# Altium schematic sheet fastedge-ADCMP572.SchDoc
size A4; SheetNumber: 1; SheetTotal: 1
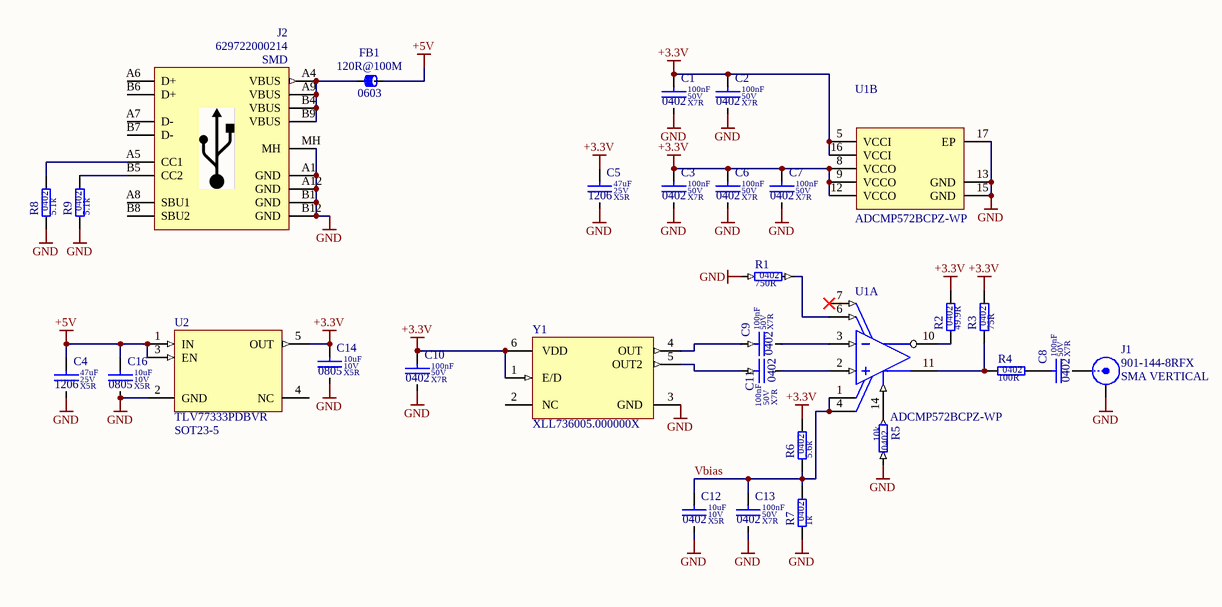
[diagram p0: fastedge-ADCMP572.SchDoc]

## Parts
C1  value 100nF  Dielectric: X7R  Voltage: 50V  SCH_Footprint: 0402  [C_0402_1005]  (hidden comment: Ceramic X7R)
C2  value 100nF  Dielectric: X7R  Voltage: 50V  SCH_Footprint: 0402  [C_0402_1005]  (hidden comment: Ceramic X7R)
C3  value 100nF  Dielectric: X7R  Voltage: 50V  SCH_Footprint: 0402  [C_0402_1005]  (hidden comment: Ceramic X7R)
C4  value 47uF  Dielectric: X5R  Voltage: 25V  SCH_Footprint: 1206  [C_1206_3216]  (hidden comment: Ceramic X5R)
C5  value 47uF  Dielectric: X5R  Voltage: 25V  SCH_Footprint: 1206  [C_1206_3216]  (hidden comment: Ceramic X5R)
C6  value 100nF  Dielectric: X7R  Voltage: 50V  SCH_Footprint: 0402  [C_0402_1005]  (hidden comment: Ceramic X7R)
C7  value 100nF  Dielectric: X7R  Voltage: 50V  SCH_Footprint: 0402  [C_0402_1005]  (hidden comment: Ceramic X7R)
C8  value 100nF  Dielectric: X7R  Voltage: 50V  SCH_Footprint: 0402  [C_0402_1005]  (hidden comment: Ceramic X7R)
C9  value 100nF  Dielectric: X7R  Voltage: 50V  SCH_Footprint: 0402  [C_0402_1005]  (hidden comment: Ceramic X7R)
C10  value 100nF  Dielectric: X7R  Voltage: 50V  SCH_Footprint: 0402  [C_0402_1005]  (hidden comment: Ceramic X7R)
C11  value 100nF  Dielectric: X7R  Voltage: 50V  SCH_Footprint: 0402  [C_0402_1005]  (hidden comment: Ceramic X7R)
C12  value 10uF  Dielectric: X5R  Voltage: 10V  SCH_Footprint: 0402  [C_0402_1005]  (hidden comment: Ceramic X5R)
C13  value 100nF  Dielectric: X7R  Voltage: 50V  SCH_Footprint: 0402  [C_0402_1005]  (hidden comment: Ceramic X7R)
C14  value 10uF  Dielectric: X5R  Voltage: 10V  SCH_Footprint: 0805  [C_0805_2012]  (hidden comment: Ceramic X5R)
C16  value 10uF  Dielectric: X5R  Voltage: 10V  SCH_Footprint: 0805  [C_0805_2012]  (hidden comment: Ceramic X5R)
FB1  value 120R@100M  SCH_Footprint: 0603  [FB_0603_1608]  (hidden comment: Ferrite bead)
J1  value 901-144-8RFX  [J_SMA_VERTICAL]  (hidden comment: SMA VERTICAL)
J2  value 629722000214  SCH_Footprint: SMD  [J_USB_C_629722000214]  (hidden comment: USB 2.0 Type C)
R1  value 750R  SCH_Footprint: 0402  [R_0402_1005]  (hidden comment: Resistor)
R2  value 49.9R  SCH_Footprint: 0402  [R_0402_1005]  (hidden comment: Resistor)
R3  value 75R  SCH_Footprint: 0402  [R_0402_1005]  (hidden comment: Resistor)
R4  value 100R  SCH_Footprint: 0402  [R_0402_1005]  (hidden comment: Resistor)
R5  value 10k  SCH_Footprint: 0402  [R_0402_1005]  (hidden comment: Resistor)
R6  value 5.6k  SCH_Footprint: 0402  [R_0402_1005]  (hidden comment: Resistor)
R7  value 1k  SCH_Footprint: 0402  [R_0402_1005]  (hidden comment: Resistor)
R8  value 5.1k  SCH_Footprint: 0402  [R_0402_1005]  (hidden comment: Resistor)
R9  value 5.1k  SCH_Footprint: 0402  [R_0402_1005]  (hidden comment: Resistor)
U1  ADCMP572BCPZ-WP  [ADI-CP-16-3_L]  (parts A,B of 2)
U2  value TLV77333PDBVR  SCH_Footprint: SOT23-5  [SOT23-5_SC74A_SOT753_M]  (hidden comment: LDO Voltage Regulators 300-mA high-PSRR low -IQ low-dropout regu)
Y1  XLL736005.000000X  [JU6_MFG]

## Nets
+3.3V: C1.1 C2.1 C3.1 C5.1 C6.1 C7.1 C10.1 C14.1 R2.2 R3.2 R6.2 U1.5(VCCI) U1.8(VCCO) U1.9(VCCO) U1.12(VCCO) U1.16(VCCI) U2.5(OUT) Y1.1(E/D) Y1.6(VDD)
+5V: C4.1 C16.1 FB1.2 U2.1(IN) U2.3(EN)
GND: C1.2 C2.2 C3.2 C4.2 C5.2 C6.2 C7.2 C10.2 C12.2 C13.2 C14.2 C16.2 J1.GND J2.A1(GND) J2.A12(GND) J2.B1(GND) J2.B12(GND) J2.MH R1.1 R5.2 R7.1 R8.1 R9.1 U1.13(GND) U1.15(GND) U1.17(EP) U2.2(GND) Y1.3(GND)
Vbias: C12.1 C13.1 R6.1 R7.2 U1.1(VTP) U1.4(VTN)
NetC8_1: C8.1 R4.2
NetC8_2: C8.2 J1.1(X)
NetC9_1: C9.1 Y1.4(OUT)
NetC9_2: C9.2 U1.3(VN)
NetC11_1: C11.1 Y1.5(OUT2)
NetC11_2: C11.2 U1.2(VP)
NetFB1_1: FB1.1 J2.A4(VBUS) J2.A9(VBUS) J2.B4(VBUS) J2.B9(VBUS)
NetJ2_A5: J2.A5(CC1) R8.2
NetJ2_B5: J2.B5(CC2) R9.2
NetR1_2: R1.2 U1.6(~{LE})
NetR2_1: R2.1 U1.10(~{Q})
NetR3_1: R3.1 R4.1 U1.11(Q)
NetR5_1: R5.1 U1.14(HYS)

Not connected (* = marked no-connect by the designer): J2 A6(D+) A7(D-) A8(SBU1) B6(D+) B7(D-) B8(SBU2); U1 7(LE)*; U2 4(NC); Y1 2(NC)

## Library data of the parts
C1-C3 C6-C11 C13 = C_100nF_50V_X7R_0402_10: Capacitor; Manufacturer: Murata; Manufacturer Part Number: GRM155R71H104KE14D; Tolerance (%): 10; Part Number: C_100nF_50V_X7R_0402_10; HelpURL: http://docs-europe.electrocomponents.com/webdocs/145f/0900766b8145f9d2.pdf; Supplier 1: TME; Supplier Part Number 1: GRM155R71H104KE14D; Supplier 2: RS Components; Supplier Part Number 2: 8847087; Supplier 3: Farnell; Supplier Part Number 3: 2611912; Supplier 4: Mouser; Supplier Part Number 4: 81-GRM155R71H104KE4D; Supplier 5: Digi-Key; Supplier Part Number 5: 490-10700-1-ND; Supplier 6: LCSC
C4 C5 = C_47uF_25V_X5R_1206_20: Capacitor; Manufacturer: TDK; Manufacturer Part Number: C3216X5R1E476M160AC; Tolerance (%): 20; Part Number: C_47uF_25V_X5R_1206_20; HelpURL: https://product.tdk.com/system/files/dam/doc/product/capacitor/ceramic/mlcc/catalog/mlcc_commercial_general_en.pdf; Supplier 1: TME; Supplier Part Number 1: C3216X5R1E476MAC; Supplier 2: RS Components; Supplier Part Number 2: 7883060P; Supplier 3: Farnell; Supplier Part Number 3: 2525172; Supplier 4: Mouser; Supplier Part Number 4: 810-C3216X5R1E476M; Supplier 5: Digi-Key; Supplier Part Number 5: 445-8047-1-ND; Supplier 6: LCSC
C12 = C_10uF_10V_X5R_0402_20: Capacitor; Manufacturer: Murata; Manufacturer Part Number: GRM155R61A106ME11D; Tolerance (%): 20; Part Number: C_10uF_10V_X5R_0402_20; HelpURL: https://search.murata.co.jp/Ceramy/image/img/A01X/G101/ENG/GRM155R61A106ME11-01A.pdf; Supplier 1: TME; Supplier Part Number 1: GRM155R61A106ME11D; Supplier 2: RS Components; Supplier Part Number 2: 260-8765P; Supplier 3: Farnell; Supplier Part Number 3: 3785802; Supplier 4: Mouser; Supplier Part Number 4: 81-GRM155R61A106ME1D; Supplier 5: Digi-Key; Supplier Part Number 5: 490-GRM155R61A106ME11DCT-ND; Supplier 6: LCSC; Supplier Part Number 6: C408132
C14 C16 = C_10uF_10V_X5R_0805_10: Capacitor; Manufacturer: Kemet; Manufacturer Part Number: C0805C106K8PACTU; Tolerance (%): 10; Part Number: C_10uF_10V_X5R_0805_10; HelpURL: https://www.mouser.pl/datasheet/2/447/KEM_C1006_X5R_SMD-3316465.pdf; Supplier 1: TME; Supplier Part Number 1: C0805C106K8PAC; Supplier 2: RS Components; Supplier Part Number 2: 8029850; Supplier 3: Farnell; Supplier Part Number 3: 1463362; Supplier 4: Mouser; Supplier Part Number 4: 80-C0805C106K8P; Supplier 5: Digi-Key; Supplier Part Number 5: 399-C0805C106K8PAC7800CT-ND; Supplier 6: LCSC
FB1 = FB_BLM18AG121SH1D: Manufacturer: Murata; Current: 800mA; Resistance: 180mR; Part Number: FB_BLM18AG121SH1D; HelpURL: https://www.murata.com/en-us/api/pdfdownloadapi?cate=cgsubChipFerriBead&partno=BLM18AG121SH1%23; Manufacturer Part Number: BLM18AG121SH1D; Supplier 1: TME; Supplier Part Number 1: BLM18AG121SH1D; Supplier 2: RS Components; Supplier 3: Farnell; Supplier Part Number 3: 2443234; Supplier 4: Mouser; Supplier Part Number 4: 81-BLM18AG121SH1D; Supplier 5: Digi-Key; Supplier Part Number 5: 490-11024-1-ND; Supplier 6: LCSC
J1 = J_SMA_VERTICAL: SMA connector; Manufacturer: Amphenol; SCH_Footprint: SMA VERTICAL; Part Number: J_SMA_VERTICAL; HelpURL: http://www.mouser.com/ds/2/18/C901-144-8RFX-710432.pdf; Manufacturer Part Number: 901-144-8RFX; Supplier 1: TME; Supplier Part Number 1: 901-144-8RFX; Supplier 2: RS Components; Supplier Part Number 2: 1440894; Supplier 3: Farnell; Supplier Part Number 3: 1339820; Supplier 4: Mouser; Supplier Part Number 4: 523-901-144-8RFX; Supplier 5: Digi-Key; Supplier Part Number 5: ARFX1231-ND; Supplier 6: LCSC
J2 = J_USB_C_629722000214: Manufacturer: Wurth; Part Number: J_USB_C_629722000214; HelpURL: https://www.we-online.com/components/products/datasheet/629722000214.pdf; Manufacturer Part Number: 629722000214; Supplier 1: TME; Supplier 2: RS Components; Supplier 3: Farnell; Supplier Part Number 3: 4146212; Supplier 4: Mouser; Supplier Part Number 4: 710-629722000214; Supplier 5: Digi-Key; Supplier Part Number 5: 732-629722000214CT-ND; Supplier 6: LCSC
R1 = R_750R_0402_1: Manufacturer: Panasonic; Manufacturer Part Number: ERJ-S02F7500X; Voltage: 50V; Power: 100mW; Tolerance: 1%; Part Number: R_750R_0402_1; HelpURL: https://industrial.panasonic.com/cdbs/www-data/pdf/RDP0000/AOA0000C334.pdf; Supplier 1: TME; Supplier 2: RS Components; Supplier 3: Farnell; Supplier Part Number 3: 3310159; Supplier 4: Mouser; Supplier Part Number 4: 667-ERJ-S02F7500X; Supplier 5: Digi-Key; Supplier Part Number 5: ERJ-S02F7500X-ND; Supplier 6: LCSC; Supplier Part Number 6: C4025496
R2 = R_49.9R_0402_1_AECQ0: Manufacturer: Panasonic; Manufacturer Part Number: ERJ-2RKF49R9X; Voltage: 50V; Power: 100mW; Tolerance: 1%; AEC-Q: 0; Part Number: R_49.9R_0402_1_AECQ0; HelpURL: https://industrial.panasonic.com/cdbs/www-data/pdf/RDA0000/AOA0000C304.pdf; Supplier 1: TME; Supplier Part Number 1: ERJ2RKF49R9X; Supplier 2: RS Components; Supplier 3: Farnell; Supplier Part Number 3: 2059109; Supplier 4: Mouser; Supplier Part Number 4: 667-ERJ-2RKF49R9X; Supplier 5: Digi-Key; Supplier Part Number 5: P49.9LCT-ND; Supplier 6: LCSC; Supplier Part Number 6: C441726
R3 = R_75R_0402_1_AECQ0: Manufacturer: Panasonic; Manufacturer Part Number: ERJ-2RKF75R0X; Voltage: 50V; Power: 100mW; Tolerance: 1%; AEC-Q: 0; Part Number: R_75R_0402_1_AECQ0; HelpURL: https://industrial.panasonic.com/cdbs/www-data/pdf/RDA0000/AOA0000C304.pdf; Supplier 1: TME; Supplier Part Number 1: ERJ2RKF75R0X; Supplier 2: RS Components; Supplier 3: Farnell; Supplier Part Number 3: 2059111; Supplier 4: Mouser; Supplier Part Number 4: 667-ERJ-2RKF75R0X; Supplier 5: Digi-Key; Supplier Part Number 5: P75.0LCT-ND; Supplier 6: LCSC; Supplier Part Number 6: C413061
R4 = R_100R_0402_1_AECQ0: Manufacturer: Panasonic; Manufacturer Part Number: ERJ-2RKF1000X; Voltage: 50V; Power: 100mW; Tolerance: 1%; AEC-Q: 0; Part Number: R_100R_0402_1_AECQ0; HelpURL: https://industrial.panasonic.com/cdbs/www-data/pdf/RDA0000/AOA0000C304.pdf; Supplier 1: TME; Supplier Part Number 1: ERJ2RKF1000X; Supplier 2: RS Components; Supplier 3: Farnell; Supplier Part Number 3: 2302528; Supplier 4: Mouser; Supplier Part Number 4: 667-ERJ-2RKF1000X; Supplier 5: Digi-Key; Supplier Part Number 5: P100LCT-ND; Supplier 6: LCSC
R5 = R_10k_0402_1: Manufacturer: Yageo; Manufacturer Part Number: RC0402FR-0710KL; Voltage: 50V; Power: 63mW; Tolerance: 1%; Part Number: R_10k_0402_1; HelpURL: http://www.tme.eu/pl/Document/1a2bc76e2be68b3b1670068306778ce6/rc0402yageo.pdf; Supplier 1: TME; Supplier Part Number 1: RC0402FR-0710K; Supplier 2: RS Components; Supplier 3: Farnell; Supplier 4: Mouser; Supplier 5: Digi-Key; Supplier 6: LCSC
R6 = R_5.6k_0402_1: Manufacturer: Walsin; Manufacturer Part Number: WR04X5601FTL; Voltage: 50V; Power: 63mW; Tolerance: 1%; Part Number: R_5.6k_0402_1; HelpURL: https://datasheet.octopart.com/WR04X5601FTL-Walsin-Technologies-datasheet-48038251.pdf; Supplier 1: TME; Supplier 2: RS Components; Supplier 3: Farnell; Supplier Part Number 3: 2502556; Supplier 4: Mouser; Supplier 5: Digi-Key; Supplier 6: LCSC
R7 = R_1k_0402_1: Manufacturer: Yageo; Manufacturer Part Number: RC0402FR-071K; Voltage: 50V; Power: 63mW; Tolerance: 1%; Part Number: R_1k_0402_1; HelpURL: http://www.tme.eu/pl/Document/1a2bc76e2be68b3b1670068306778ce6/rc0402yageo.pdf; Supplier 1: TME; Supplier Part Number 1: RC0402FR-071K; Supplier 2: RS Components; Supplier 3: Farnell; Supplier Part Number 3: 9239235; Supplier 4: Mouser; Supplier Part Number 4: 603-RC0402FR-071KP; Supplier 5: Digi-Key; Supplier Part Number 5: 311-1.00KLRCT-ND; Supplier 6: LCSC
R8 R9 = R_5.1k_0402_1: Manufacturer: Yageo; Manufacturer Part Number: RC0402FR-075K1L; Voltage: 50V; Power: 63mW; Tolerance: 1%; Part Number: R_5.1k_0402_1; HelpURL: https://www.tme.eu/Document/92d375a0b5e7ae71098c0026a66a663c/RC0201FR-07100KL.PDF; Supplier 1: TME; Supplier Part Number 1: RC0402FR-075K1L; Supplier 2: RS Components; Supplier Part Number 2: 1987836; Supplier 3: Farnell; Supplier Part Number 3: 1458805; Supplier 4: Mouser; Supplier Part Number 4: 603-RC0402FR-075K1L; Supplier 5: Digi-Key; Supplier Part Number 5: 311-5.10KLRCT-ND; Supplier 6: LCSC
U1 = CMP-0783-00028-1: Ultrafast Single-Supply SiGe Comparator, 3.3 to 5 V, 150 ps Delay, Industrial, 16-pin QFN (CP-16-3), Tray; Manufacturer: Analog Devices; Supply Current: 3.3, 5; Voltage Supply (V): 3.3 to 5; Input Range (V): -0.5 to VCCI+0.5; ComponentLink3Description: Package Specification; ComponentLink1Description: Manufacturer URL; Code_JEDEC: MO-220-VEED-2; ComponentLink4URL: Product URL:http://www.analog.com/en/special-linear-functions/comparators/adcmp572/products/product.html; PartNumber: ADCMP572BCPZ-WP; ComponentLink2URL: http://www.analog.com/static/imported-files/data_sheets/ADCMP572_573.pdf; DatasheetVersion: Rev. A; ComponentLink4Description: URL Link1; ComponentLink1URL: http://www.analog.com/en/index.html; Packing: Tray; ComponentLink3URL: http://www.analog.com/static/imported-files/packages/PKG_PDF/LFCSP(CP)/CP_16_3.pdf; ComponentLink2Description: Datasheet; Mounting Technology: Surface Mount; PackageDescription: 16-Pin Lead Frame Chip Scale Package, Body 3 x 3 mm, Pitch 0.5 mm; PackageReference: CP-16-3
U2 = VL_TLV77333PDBVR: TPS7A25; Manufacturer: Texas Instruments; Voltage: 3.3V; Current: 300mA; Part Number: VL_TLV77333PDBVR; HelpURL: https://www.ti.com/lit/ds/symlink/tlv773.pdf?ts=1737595386790; Manufacturer Part Number: TLV77333PDBVR; Supplier 1: TME; Supplier 2: RS Components; Supplier 3: Farnell; Supplier 4: Mouser; Supplier Part Number 4: 595-TLV77333PDBVR; Supplier 5: Digi-Key; Supplier Part Number 5: 296-TLV77333PDBVRCT-ND; Supplier 6: LCSC
Y1 = CMP-00572-106942813-3: Renesas XL Family of Low Phase Noise Quartz-based PLL Oscillators; Output Type: LVDS; Max Output Frequency: 9.9MHz; Min Input Voltage: 3.135V; Max Input Voltage: 3.465V; Case/Package: CLCC; Height: 1.45mm; ComponentLink3URL: https://www.renesas.com/en/document/psc/ju6-package-outline-70-x-50-mm-body-13-mm-thick; ComponentLink1Description: Manufacturer's Website; Number of Pins: 6; Min Operating Temperature: -20°C; HelpURL: https://octopart.com/cad-content/api/get-model-datasheet/15189/106942813; ComponentLink3Description: Manufacturer's Package Drawing; ComponentLink2URL: https://octopart.com/cad-content/api/get-model-datasheet/15189/106942813; Mount: Surface Mount; Max Operating Temperature: 70°C; ComponentLink2Description: Datasheet URL; ComponentLink1URL: http://www.renesas.com; RoHS: Compliant